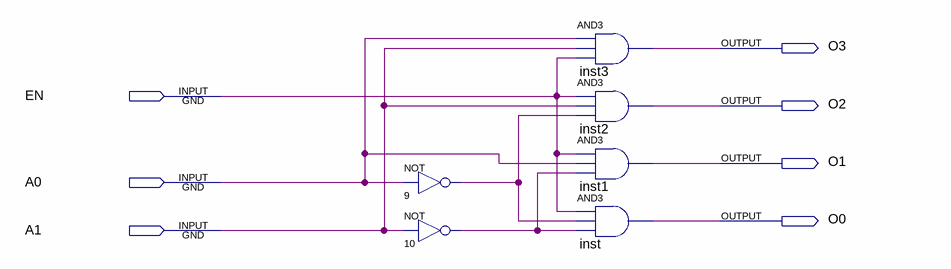
[diagram p0: schematic sheet]
// Quartus schematic decoder24.bdf as structural Verilog: 6 symbols, 7 pins
module decoder24 (
  input  EN,
  input  A0,
  input  A1,
  output O3,
  output O2,
  output O1,
  output O0
);

  wire n9_out, n10_out;

  not u_9 (n9_out, A0);
  not u_10 (n10_out, A1);
  and inst3 (O3, A0, A1, EN);
  and inst2 (O2, EN, A1, n9_out);
  and inst1 (O1, EN, A0, n10_out);
  and inst (O0, EN, n9_out, n10_out);
endmodule
